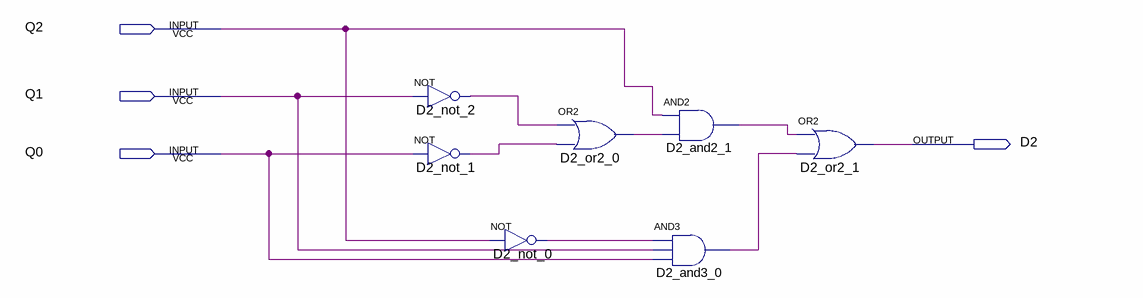
[diagram p0: schematic sheet]
// Quartus schematic D2_control.bdf as structural Verilog: 7 symbols, 4 pins
module D2_control (
  input  Q2,
  input  Q1,
  input  Q0,
  output D2
);

  wire D2_and2_1_out, D2_and3_0_out, D2_not_0_out, D2_not_1_out, D2_not_2_out, D2_or2_0_out;

  not D2_not_2 (D2_not_2_out, Q1);
  not D2_not_1 (D2_not_1_out, Q0);
  not D2_not_0 (D2_not_0_out, Q2);
  or D2_or2_0 (D2_or2_0_out, D2_not_2_out, D2_not_1_out);
  and D2_and2_1 (D2_and2_1_out, Q2, D2_or2_0_out);
  and D2_and3_0 (D2_and3_0_out, D2_not_0_out, Q1, Q0);
  or D2_or2_1 (D2, D2_and2_1_out, D2_and3_0_out);
endmodule
